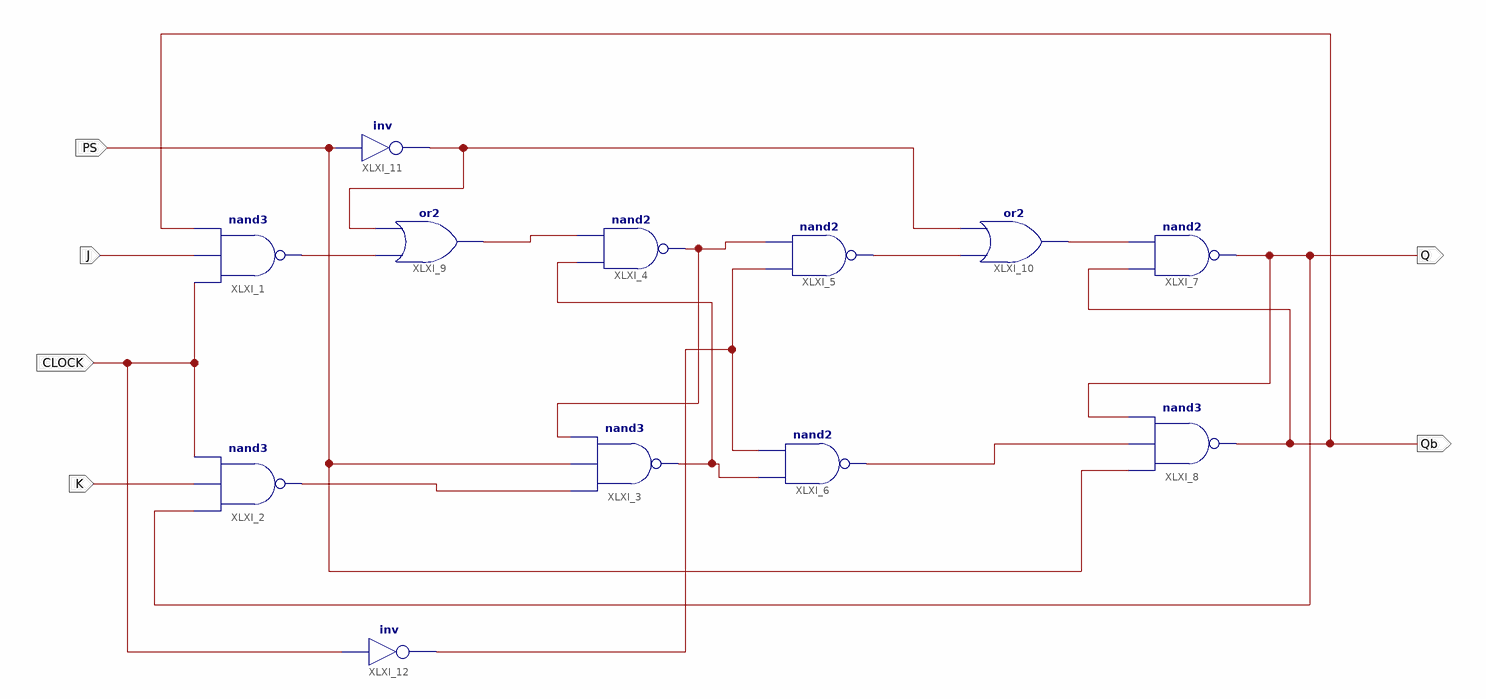
[diagram p0: schematic sheet 1]
// Xilinx ISE schematic Master_Slave.sch (artix7) as structural Verilog: 12 symbols, 6 ports
module Master_Slave (
  input  CLOCK,
  input  J,
  input  PS,
  input  K,
  output Q,
  output Qb
);

  wire XLXN_53, XLXN_55, XLXN_56, XLXN_57, XLXN_58, XLXN_59, XLXN_67, XLXN_69, XLXN_70, XLXN_71;

  nand XLXI_1 (XLXN_67, CLOCK, J, Qb);
  nand XLXI_2 (XLXN_69, Q, K, CLOCK);
  nand XLXI_3 (XLXN_58, XLXN_69, PS, XLXN_56);
  nand XLXI_4 (XLXN_56, XLXN_58, XLXN_55);
  nand XLXI_5 (XLXN_71, XLXN_57, XLXN_56);
  nand XLXI_6 (XLXN_59, XLXN_58, XLXN_57);
  nand XLXI_7 (Q, Qb, XLXN_70);
  nand XLXI_8 (Qb, PS, XLXN_59, Q);
  or XLXI_9 (XLXN_55, XLXN_67, XLXN_53);
  or XLXI_10 (XLXN_70, XLXN_71, XLXN_53);
  not XLXI_11 (XLXN_53, PS);
  not XLXI_12 (XLXN_57, CLOCK);
endmodule
